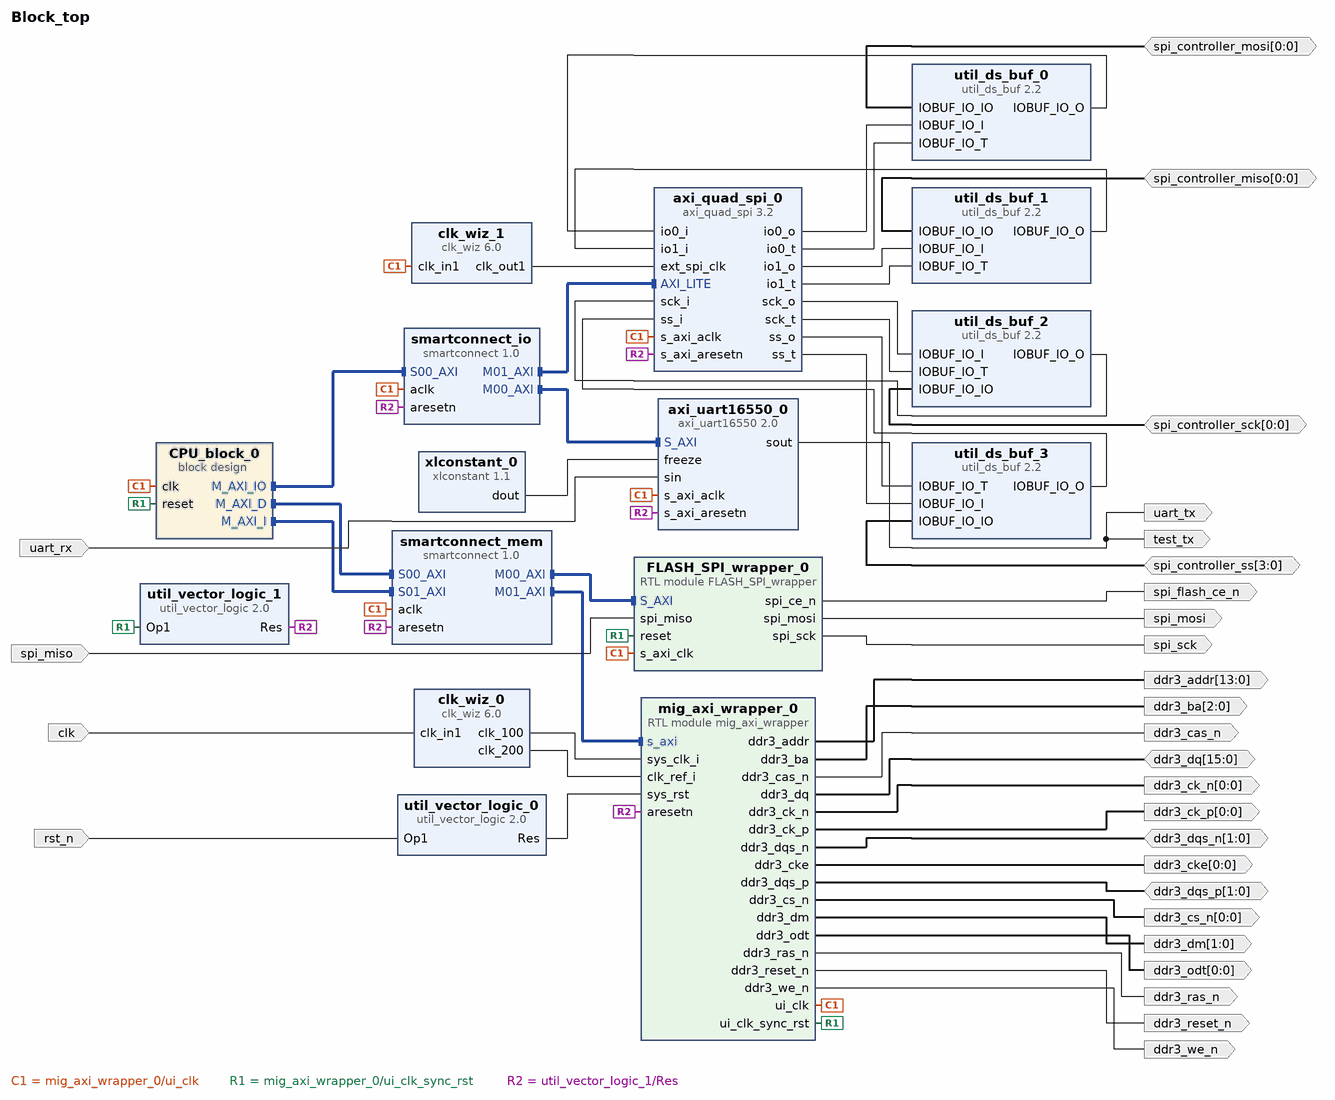
[diagram p0: block diagram of the top level]
# Vivado block design Block_top, xc7a35tftg256-2, Vivado 2025.2
create_bd_design Block_top

create_bd_port -dir IO -from 15 -to 0 ddr3_dq
create_bd_port -dir IO -from 1 -to 0 ddr3_dqs_n
create_bd_port -dir O ddr3_ras_n
create_bd_port -dir IO -from 1 -to 0 ddr3_dqs_p
create_bd_port -dir O -from 13 -to 0 ddr3_addr
create_bd_port -dir O -from 2 -to 0 ddr3_ba
create_bd_port -dir O ddr3_cas_n
create_bd_port -dir O ddr3_reset_n
create_bd_port -dir O -from 0 -to 0 ddr3_ck_p
create_bd_port -dir O -from 0 -to 0 ddr3_ck_n
create_bd_port -dir O -from 0 -to 0 ddr3_cs_n
create_bd_port -dir O -from 0 -to 0 ddr3_odt
create_bd_port -dir O -from 1 -to 0 ddr3_dm
create_bd_port -dir O ddr3_we_n
create_bd_port -dir O -from 0 -to 0 ddr3_cke
create_bd_port -dir I -type rst rst_n
set_property -dict {CONFIG.POLARITY ACTIVE_LOW} [get_bd_ports rst_n]
create_bd_port -dir I -type clk clk
create_bd_port -dir I spi_miso
create_bd_port -dir O spi_mosi
create_bd_port -dir O spi_sck
create_bd_port -dir O spi_flash_ce_n
create_bd_port -dir I uart_rx
create_bd_port -dir O uart_tx
create_bd_port -dir O -type data test_tx
create_bd_port -dir IO -from 0 -to 0 spi_controller_mosi
create_bd_port -dir IO -from 0 -to 0 spi_controller_miso
create_bd_port -dir IO -from 0 -to 0 spi_controller_sck
create_bd_port -dir IO -from 3 -to 0 spi_controller_ss

create_bd_cell -type ip -vlnv xilinx.com:ip:clk_wiz:6.0 clk_wiz_0
set_property -dict [list \
  CONFIG.CLKOUT2_JITTER 114.829 \
  CONFIG.CLKOUT2_PHASE_ERROR 98.575 \
  CONFIG.CLKOUT2_REQUESTED_OUT_FREQ 200.000 \
  CONFIG.CLKOUT2_USED true \
  CONFIG.CLK_OUT1_PORT clk_100 \
  CONFIG.CLK_OUT2_PORT clk_200 \
  CONFIG.MMCM_CLKOUT1_DIVIDE 5 \
  CONFIG.NUM_OUT_CLKS 2 \
  CONFIG.USE_LOCKED false \
  CONFIG.USE_RESET false \
] [get_bd_cells clk_wiz_0]
create_bd_cell -type ip -vlnv xilinx.com:ip:util_vector_logic:2.0 util_vector_logic_0
set_property -dict {CONFIG.C_OPERATION not CONFIG.C_SIZE 1} [get_bd_cells util_vector_logic_0]
create_bd_cell -type module -reference mig_axi_wrapper mig_axi_wrapper_0
create_bd_cell -type ip -vlnv xilinx.com:ip:util_vector_logic:2.0 util_vector_logic_1
set_property -dict {CONFIG.C_OPERATION not CONFIG.C_SIZE 1} [get_bd_cells util_vector_logic_1]
create_bd_cell -type ip -vlnv xilinx.com:ip:smartconnect:1.0 smartconnect_mem
set_property -dict {CONFIG.NUM_MI 2} [get_bd_cells smartconnect_mem]
create_bd_cell -type module -reference FLASH_SPI_wrapper FLASH_SPI_wrapper_0
create_bd_cell -type ip -vlnv xilinx.com:ip:axi_uart16550:2.0 axi_uart16550_0
set_property -dict {CONFIG.C_S_AXI_ACLK_FREQ_HZ_d 100} [get_bd_cells axi_uart16550_0]
create_bd_cell -type ip -vlnv xilinx.com:ip:xlconstant:1.1 xlconstant_0
set_property -dict {CONFIG.CONST_VAL 0} [get_bd_cells xlconstant_0]
create_bd_cell -type ip -vlnv xilinx.com:ip:smartconnect:1.0 smartconnect_io
set_property -dict {CONFIG.NUM_MI 2 CONFIG.NUM_SI 1} [get_bd_cells smartconnect_io]
create_bd_cell -type container -reference CPU_block CPU_block_0
set_property -dict [list \
  CONFIG.ACTIVE_SIM_BD CPU_block.bd \
  CONFIG.ACTIVE_SYNTH_BD CPU_block.bd \
  CONFIG.ENABLE_DFX 0 \
  CONFIG.LIST_SIM_BD CPU_block.bd \
  CONFIG.LIST_SYNTH_BD CPU_block.bd \
  CONFIG.LOCK_PROPAGATE 0 \
] [get_bd_cells CPU_block_0]
create_bd_cell -type ip -vlnv xilinx.com:ip:util_ds_buf:2.2 util_ds_buf_0
set_property -dict {CONFIG.C_BUF_TYPE IOBUF} [get_bd_cells util_ds_buf_0]
create_bd_cell -type ip -vlnv xilinx.com:ip:axi_quad_spi:3.2 axi_quad_spi_0
set_property -dict [list \
  CONFIG.C_NUM_SS_BITS 4 \
  CONFIG.C_SCK_RATIO 2 \
  CONFIG.C_USE_STARTUP 0 \
  CONFIG.FIFO_INCLUDED 1 \
  CONFIG.Master_mode 1 \
] [get_bd_cells axi_quad_spi_0]
create_bd_cell -type ip -vlnv xilinx.com:ip:clk_wiz:6.0 clk_wiz_1
set_property -dict [list \
  CONFIG.CLKOUT1_JITTER 151.636 \
  CONFIG.CLKOUT1_REQUESTED_OUT_FREQ 50 \
  CONFIG.MMCM_CLKOUT0_DIVIDE_F 20.000 \
  CONFIG.USE_LOCKED false \
  CONFIG.USE_RESET false \
] [get_bd_cells clk_wiz_1]
create_bd_cell -type ip -vlnv xilinx.com:ip:util_ds_buf:2.2 util_ds_buf_1
set_property -dict {CONFIG.C_BUF_TYPE IOBUF} [get_bd_cells util_ds_buf_1]
create_bd_cell -type ip -vlnv xilinx.com:ip:util_ds_buf:2.2 util_ds_buf_2
set_property -dict {CONFIG.C_BUF_TYPE IOBUF} [get_bd_cells util_ds_buf_2]
create_bd_cell -type ip -vlnv xilinx.com:ip:util_ds_buf:2.2 util_ds_buf_3
set_property -dict {CONFIG.C_BUF_TYPE IOBUF CONFIG.C_SIZE 4} [get_bd_cells util_ds_buf_3]

# ---- connections ----

connect_bd_intf_net [get_bd_intf_pins CPU_block_0/M_AXI_D] [get_bd_intf_pins smartconnect_mem/S00_AXI]
connect_bd_intf_net [get_bd_intf_pins CPU_block_0/M_AXI_I] [get_bd_intf_pins smartconnect_mem/S01_AXI]
connect_bd_intf_net [get_bd_intf_pins CPU_block_0/M_AXI_IO] [get_bd_intf_pins smartconnect_io/S00_AXI]
connect_bd_intf_net -intf_net smartconnect_0_M00_AXI [get_bd_intf_pins smartconnect_mem/M00_AXI] [get_bd_intf_pins FLASH_SPI_wrapper_0/S_AXI]
connect_bd_intf_net -intf_net smartconnect_0_M01_AXI [get_bd_intf_pins smartconnect_mem/M01_AXI] [get_bd_intf_pins mig_axi_wrapper_0/s_axi]
connect_bd_intf_net [get_bd_intf_pins smartconnect_io/M00_AXI] [get_bd_intf_pins axi_uart16550_0/S_AXI]
connect_bd_intf_net [get_bd_intf_pins smartconnect_io/M01_AXI] [get_bd_intf_pins axi_quad_spi_0/AXI_LITE]
connect_bd_net [get_bd_pins FLASH_SPI_wrapper_0/spi_ce_n] [get_bd_ports spi_flash_ce_n]
connect_bd_net [get_bd_pins FLASH_SPI_wrapper_0/spi_mosi] [get_bd_ports spi_mosi]
connect_bd_net [get_bd_pins FLASH_SPI_wrapper_0/spi_sck] [get_bd_ports spi_sck]
connect_bd_net [get_bd_ports ddr3_dq] [get_bd_pins mig_axi_wrapper_0/ddr3_dq]
connect_bd_net [get_bd_ports ddr3_dqs_n] [get_bd_pins mig_axi_wrapper_0/ddr3_dqs_n]
connect_bd_net [get_bd_ports ddr3_dqs_p] [get_bd_pins mig_axi_wrapper_0/ddr3_dqs_p]
connect_bd_net [get_bd_ports spi_controller_mosi] [get_bd_pins util_ds_buf_0/IOBUF_IO_IO]
connect_bd_net [get_bd_ports spi_controller_miso] [get_bd_pins util_ds_buf_1/IOBUF_IO_IO]
connect_bd_net [get_bd_ports spi_controller_sck] [get_bd_pins util_ds_buf_2/IOBUF_IO_IO]
connect_bd_net [get_bd_ports spi_controller_ss] [get_bd_pins util_ds_buf_3/IOBUF_IO_IO]
connect_bd_net [get_bd_pins axi_quad_spi_0/io0_o] [get_bd_pins util_ds_buf_0/IOBUF_IO_I]
connect_bd_net [get_bd_pins axi_quad_spi_0/io0_t] [get_bd_pins util_ds_buf_0/IOBUF_IO_T]
connect_bd_net [get_bd_pins axi_quad_spi_0/io1_o] [get_bd_pins util_ds_buf_1/IOBUF_IO_I]
connect_bd_net [get_bd_pins axi_quad_spi_0/io1_t] [get_bd_pins util_ds_buf_1/IOBUF_IO_T]
connect_bd_net [get_bd_pins axi_quad_spi_0/sck_o] [get_bd_pins util_ds_buf_2/IOBUF_IO_I]
connect_bd_net [get_bd_pins axi_quad_spi_0/sck_t] [get_bd_pins util_ds_buf_2/IOBUF_IO_T]
connect_bd_net [get_bd_pins axi_quad_spi_0/ss_o] [get_bd_pins util_ds_buf_3/IOBUF_IO_T]
connect_bd_net [get_bd_pins axi_quad_spi_0/ss_t] [get_bd_pins util_ds_buf_3/IOBUF_IO_I]
connect_bd_net [get_bd_pins axi_uart16550_0/sout] [get_bd_ports uart_tx] [get_bd_ports test_tx]
connect_bd_net -net clk_in1_0_1 [get_bd_ports clk] [get_bd_pins clk_wiz_0/clk_in1]
connect_bd_net [get_bd_pins clk_wiz_0/clk_100] [get_bd_pins mig_axi_wrapper_0/sys_clk_i]
connect_bd_net [get_bd_pins clk_wiz_0/clk_200] [get_bd_pins mig_axi_wrapper_0/clk_ref_i]
connect_bd_net [get_bd_pins clk_wiz_1/clk_out1] [get_bd_pins axi_quad_spi_0/ext_spi_clk]
connect_bd_net [get_bd_pins mig_axi_wrapper_0/ddr3_addr] [get_bd_ports ddr3_addr]
connect_bd_net [get_bd_pins mig_axi_wrapper_0/ddr3_ba] [get_bd_ports ddr3_ba]
connect_bd_net [get_bd_pins mig_axi_wrapper_0/ddr3_cas_n] [get_bd_ports ddr3_cas_n]
connect_bd_net [get_bd_pins mig_axi_wrapper_0/ddr3_ck_n] [get_bd_ports ddr3_ck_n]
connect_bd_net [get_bd_pins mig_axi_wrapper_0/ddr3_ck_p] [get_bd_ports ddr3_ck_p]
connect_bd_net [get_bd_pins mig_axi_wrapper_0/ddr3_cke] [get_bd_ports ddr3_cke]
connect_bd_net [get_bd_pins mig_axi_wrapper_0/ddr3_cs_n] [get_bd_ports ddr3_cs_n]
connect_bd_net [get_bd_pins mig_axi_wrapper_0/ddr3_dm] [get_bd_ports ddr3_dm]
connect_bd_net [get_bd_pins mig_axi_wrapper_0/ddr3_odt] [get_bd_ports ddr3_odt]
connect_bd_net [get_bd_pins mig_axi_wrapper_0/ddr3_ras_n] [get_bd_ports ddr3_ras_n]
connect_bd_net [get_bd_pins mig_axi_wrapper_0/ddr3_reset_n] [get_bd_ports ddr3_reset_n]
connect_bd_net [get_bd_pins mig_axi_wrapper_0/ddr3_we_n] [get_bd_ports ddr3_we_n]
connect_bd_net [get_bd_pins mig_axi_wrapper_0/ui_clk] \
  [get_bd_pins smartconnect_mem/aclk] [get_bd_pins axi_uart16550_0/s_axi_aclk] [get_bd_pins smartconnect_io/aclk] \
  [get_bd_pins CPU_block_0/clk] [get_bd_pins FLASH_SPI_wrapper_0/s_axi_clk] [get_bd_pins axi_quad_spi_0/s_axi_aclk] \
  [get_bd_pins clk_wiz_1/clk_in1]
connect_bd_net -net reset [get_bd_pins mig_axi_wrapper_0/ui_clk_sync_rst] \
  [get_bd_pins util_vector_logic_1/Op1] [get_bd_pins CPU_block_0/reset] [get_bd_pins FLASH_SPI_wrapper_0/reset]
connect_bd_net -net reset_n [get_bd_pins util_vector_logic_1/Res] \
  [get_bd_pins smartconnect_mem/aresetn] [get_bd_pins axi_uart16550_0/s_axi_aresetn] [get_bd_pins smartconnect_io/aresetn] \
  [get_bd_pins axi_quad_spi_0/s_axi_aresetn] [get_bd_pins mig_axi_wrapper_0/aresetn]
connect_bd_net -net rst_in [get_bd_pins util_vector_logic_0/Res] [get_bd_pins mig_axi_wrapper_0/sys_rst]
connect_bd_net -net rst_n_in [get_bd_ports rst_n] [get_bd_pins util_vector_logic_0/Op1]
connect_bd_net -net sin_0_1 [get_bd_ports uart_rx] [get_bd_pins axi_uart16550_0/sin]
connect_bd_net -net spi_miso_0_1 [get_bd_ports spi_miso] [get_bd_pins FLASH_SPI_wrapper_0/spi_miso]
connect_bd_net [get_bd_pins util_ds_buf_0/IOBUF_IO_O] [get_bd_pins axi_quad_spi_0/io0_i]
connect_bd_net [get_bd_pins util_ds_buf_1/IOBUF_IO_O] [get_bd_pins axi_quad_spi_0/io1_i]
connect_bd_net [get_bd_pins util_ds_buf_2/IOBUF_IO_O] [get_bd_pins axi_quad_spi_0/sck_i]
connect_bd_net [get_bd_pins util_ds_buf_3/IOBUF_IO_O] [get_bd_pins axi_quad_spi_0/ss_i]
connect_bd_net [get_bd_pins xlconstant_0/dout] [get_bd_pins axi_uart16550_0/freeze]

# ---- address map ----
assign_bd_address -offset 0x10000000 -range 8K -target_address_space [get_bd_addr_spaces CPU_block_0/CPU_IO_converter_0/M00_AXI] [get_bd_addr_segs axi_uart16550_0/S_AXI/Reg]
assign_bd_address -offset 0x10002000 -range 8K -target_address_space [get_bd_addr_spaces CPU_block_0/CPU_IO_converter_0/M00_AXI] [get_bd_addr_segs axi_quad_spi_0/AXI_LITE/Reg]
assign_bd_address -offset 0x80000000 -range 256M -target_address_space [get_bd_addr_spaces CPU_block_0/VexiiRV_wrapper_0/M_AXI_D] [get_bd_addr_segs FLASH_SPI_wrapper_0/S_AXI/reg0]
assign_bd_address -offset 0x90000000 -range 256M -target_address_space [get_bd_addr_spaces CPU_block_0/VexiiRV_wrapper_0/M_AXI_D] [get_bd_addr_segs mig_axi_wrapper_0/s_axi/reg0]
assign_bd_address -offset 0x80000000 -range 256M -target_address_space [get_bd_addr_spaces CPU_block_0/VexiiRV_wrapper_0/M_AXI_I] [get_bd_addr_segs FLASH_SPI_wrapper_0/S_AXI/reg0]
assign_bd_address -offset 0x90000000 -range 256M -target_address_space [get_bd_addr_spaces CPU_block_0/VexiiRV_wrapper_0/M_AXI_I] [get_bd_addr_segs mig_axi_wrapper_0/s_axi/reg0]

validate_bd_design
save_bd_design
